# EAGLE design wt41u_breakout_board_v30 (EAGLE 7.5.0)
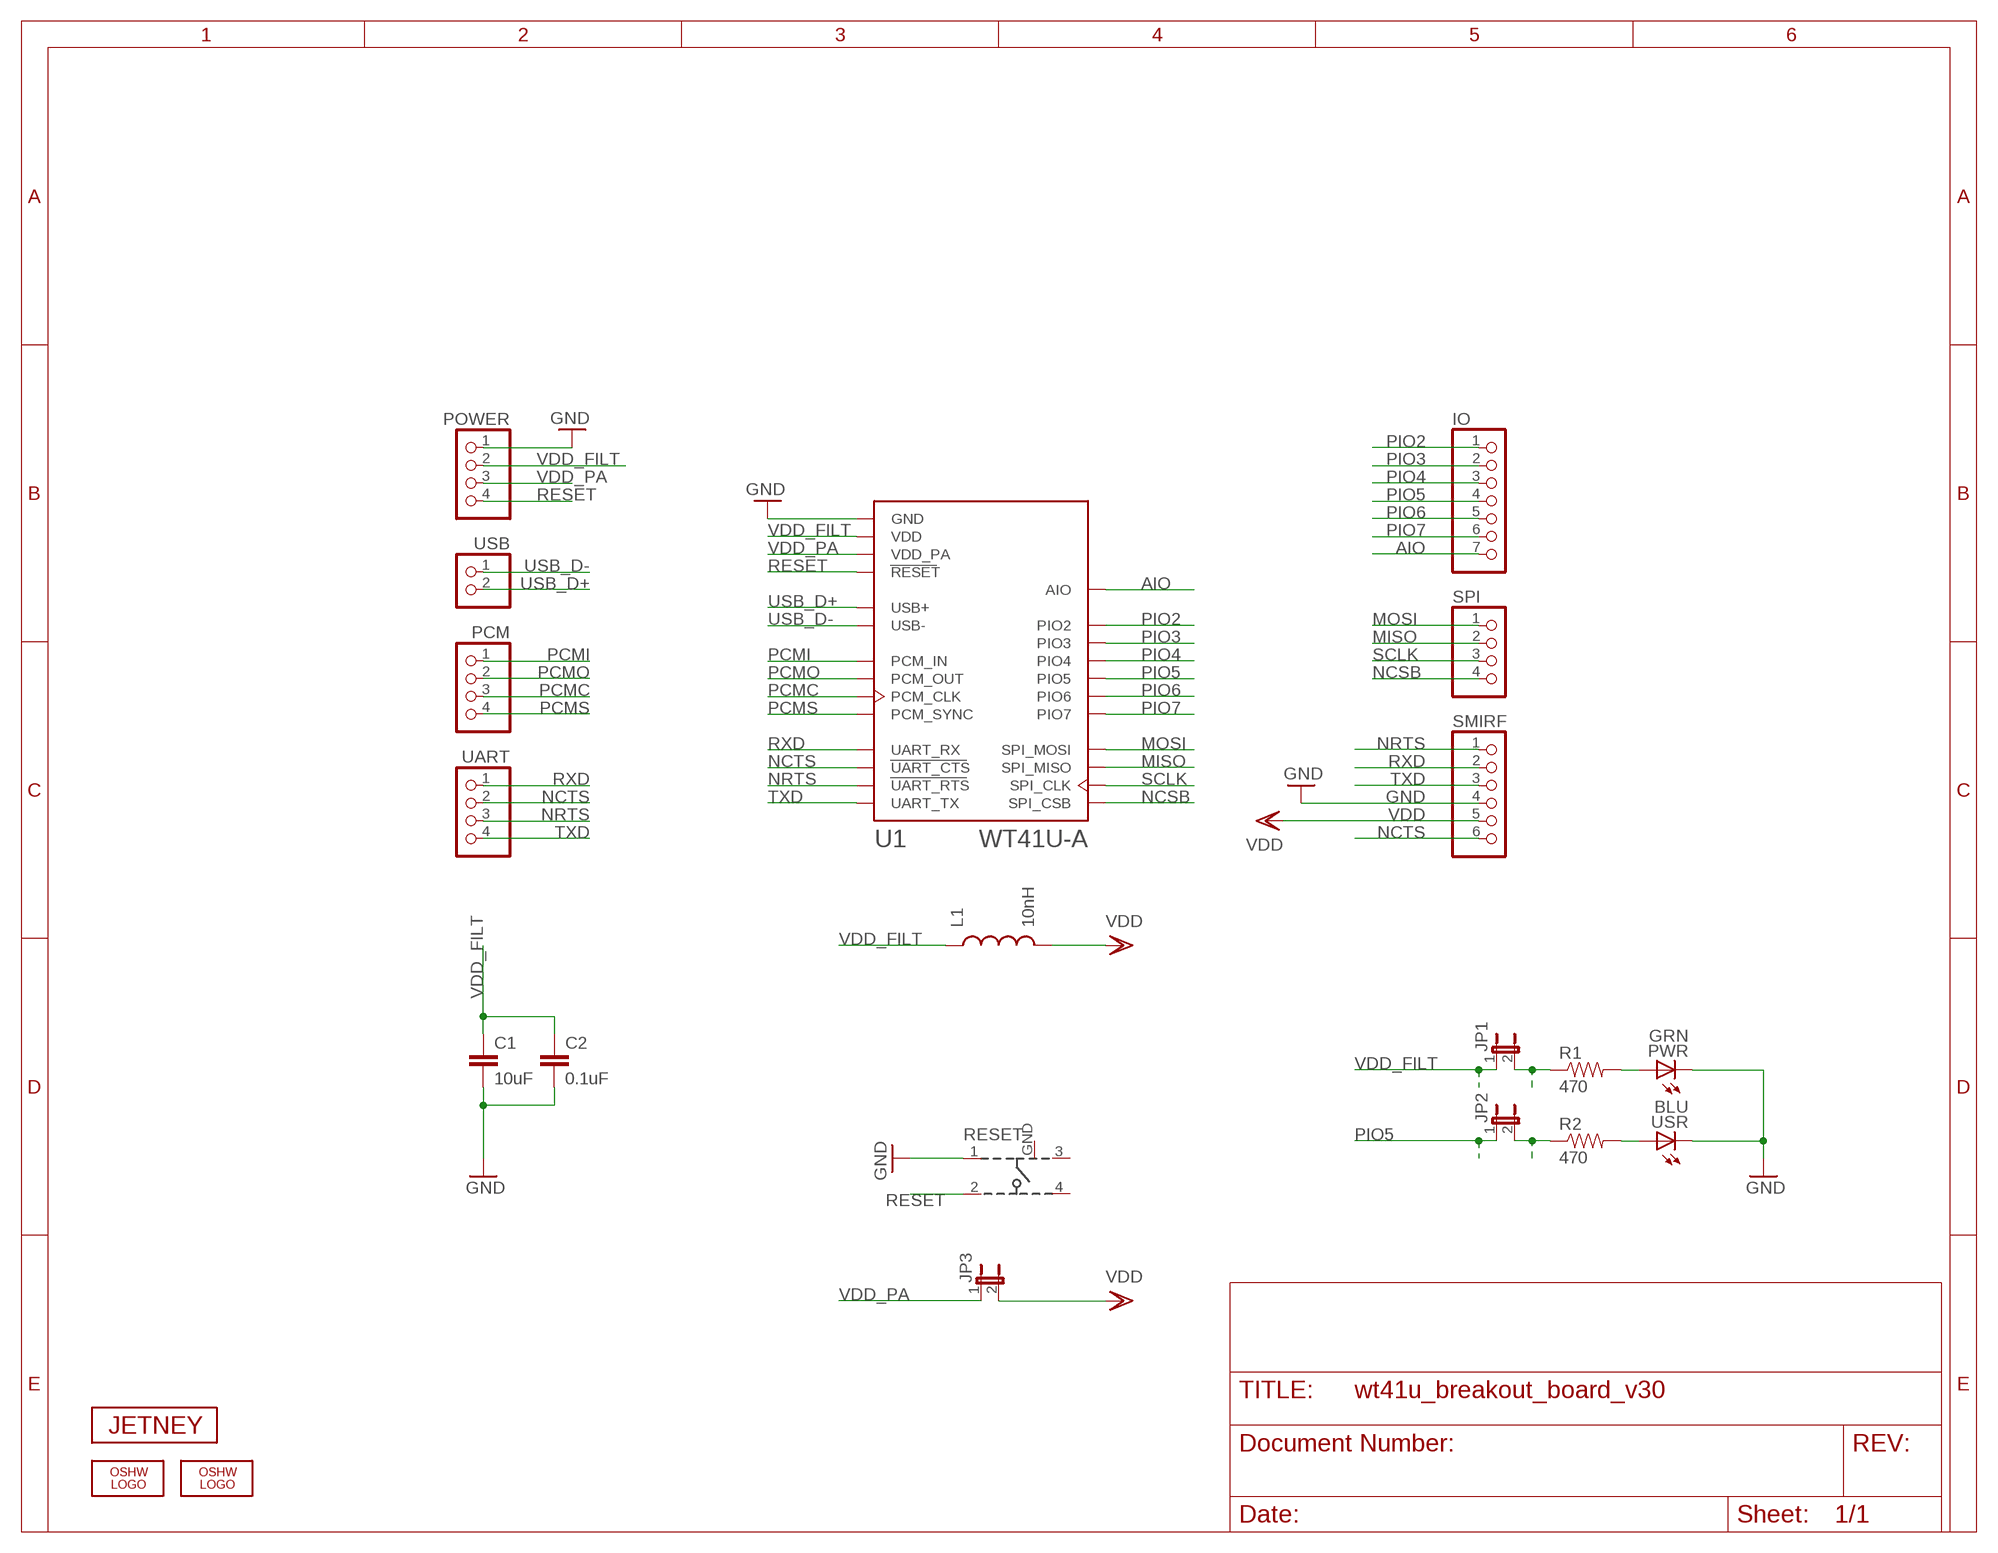
[diagram p0: schematic, sheet 1]

## Parts
C1  10uF  CAP0603-CAP  [0603-CAP]
C2  0.1uF  CAP0603-CAP  [0603-CAP]
IO  PINHD-1X7  [1X07]
JP1  JUMPER-2SMD-NC  [SJ_2S]
JP2  JUMPER-2SMD-NC  [SJ_2S]
JP3  JUMPER-2SMD-NC  [SJ_2S]
L1  10nH  INDUCTOR0603  [0603]
LOGO1  OSHW_LOGO_FILLX0070-NT  [OSHW_FILLX70_NOTEXT]
LOGO2  OSHW_LOGO_FILLX0070-NT  [OSHW_FILLX70_NOTEXT]
PCM  PINHD-1X4  [1X04]
POWER  PINHD-1X4  [1X04]
PWR  GRN  LEDCHIPLED_0805  [CHIPLED_0805]
R1  470  RESISTOR0603-RES  [0603-RES]
R2  470  RESISTOR0603-RES  [0603-RES]
RESET  101-IG  [101-IG]
SMIRF  PINHD-1X6  [1X06]
SPI  PINHD-1X4  [1X04]
U1  WT41U-A  [WT41U-A]
U$2  JETNEY-LOGO-12  [JETNEY-LOGO-12]
UART  PINHD-1X4  [1X04]
USB  PINHD-1X2  [1X02]
USR  BLU  LEDCHIPLED_0805  [CHIPLED_0805]

## Nets
AIO: IO.7 U1.AIO
GND [power]: C1.2 C2.2 POWER.1 PWR.C RESET.1 SMIRF.4 U1.GND U1.GND@2(GND) U1.GND@3(GND) U1.GND@4(GND) U1.GND@5(GND) U1.GND@6(GND) U1.GND@7(GND) U1.GND@8(GND) U1.GND@9(GND) U1.GND@10(GND) U1.GND@11(GND) U1.GND@12(GND) U1.GND@13(GND) U1.GND@14(GND) U1.GND@15(GND) U1.GND@16(GND) U1.GND@17(GND) U1.GND@18(GND) U1.GND@19(GND) U1.GND@20(GND) U1.GND@21(GND) U1.GND@22(GND) U1.GND@23(GND) U1.GND@24(GND) U1.GND@25(GND) U1.GND@26(GND) U1.GND@27(GND) U1.GND@28(GND) U1.GND@29(GND) U1.GND@30(GND) U1.GND@31(GND) USR.C
MISO: SPI.2 U1.SPI_MISO
MOSI: SPI.1 U1.SPI_MOSI
N$1: PWR.A R1.2
N$3: R2.2 USR.A
N$4: JP2.2 R2.1
NCSB: SPI.4 U1.SPI_CSB
NCTS: SMIRF.6 U1.UART_CTS UART.2
NRTS: SMIRF.1 U1.UART_RTS UART.3
PCMC: PCM.3 U1.PCM_CLK
PCMI: PCM.1 U1.PCM_IN
PCMO: PCM.2 U1.PCM_OUT
PCMS: PCM.4 U1.PCM_SYNC
PIO2: IO.1 U1.PIO2
PIO3: IO.2 U1.PIO3
PIO4: IO.3 U1.PIO4
PIO5: IO.4 JP2.1 U1.PIO5
PIO6: IO.5 U1.PIO6
PIO7: IO.6 U1.PIO7
RESET: POWER.4 RESET.2 U1.RESET
RXD: SMIRF.2 U1.UART_RX UART.1
SCLK: SPI.3 U1.SPI_CLK
TXD: SMIRF.3 U1.UART_TX UART.4
USB_D+: U1.USB+ USB.2
USB_D-: U1.USB- USB.1
VDD [power]: JP3.2 L1.2 SMIRF.5
VDD_FILT [power]: C1.1 C2.1 JP1.1 L1.1 POWER.2 U1.VDD
VDD_PA [power]: JP3.1 POWER.3 U1.VDD_PA
VDDJP1 [power]: JP1.2 R1.1
Unconnected: RESET.3 RESET.4

## Power pins joined to a net without a drawn wire
GND: RESET.GND

## Library data of the parts
C1 C2 = SparkFun:CAP: Capacitor Standard 0603 ceramic capacitor, and 0.1" leaded capacitor.
IO = sf-pinhead:PINHD-1X7: PIN HEADER
JP1-JP3 = SparkFun:JUMPER-2: Jumper Basic 0.1" spaced jumper. Use with breakaway headers.
L1 = SparkFun:INDUCTOR: Inductors Basic Inductor/Choke - 0603 and 1206. Footprints are not proven and vary greatly between part numbers.
LOGO1 LOGO2 = oshw-logo:OSHW_LOGO_FILL
PCM POWER SPI UART = sf-pinhead:PINHD-1X4: PIN HEADER
PWR USR = adafruit:LED: LED OSRAM: - CHIPLED LG R971, LG N971, LY N971, LG Q971, LY Q971, LO R971, LY R971 LH N974, LH R974 LS Q976, LO Q976, LY Q976 LO Q996 - Hyper CHIPLED LW Q18S LB Q993, LB Q99A, LB R99A - SideLED LS A670, LO A670, LY A670, LG A670, LP A670 LB A673, LV A673, LT A673, LW A673 LH A674 LY A675 LS A676, LA A676, LO A676, LY A676, LW A676 LS A679, LY A679, LG A679 - Hyper Micro SIDELED® LS Y876, LA Y876, LO Y876, LY Y876 LT Y87S - SmartLED LW L88C, LW L88S LB L89C, LB L89S, LG L890 LS L89K, LO L89K, LY L89K LS L896, LA L896, LO L896, LY L896 - TOPLED LS T670, LO T670, LY T670, LG T670, LP T670 LSG T670, LSP T670, LSY T670, LOP T670, LYG T670 LG T671, LOG T671, LSG T671 LB T673, LV T673, LT T673, LW T673 LH T674 LS T676, LA T676, LO T676, LY T676, LB T676, LH T676, LSB T676, LW T676 LB T67C, LV T67C, LT T67C, LS T67K, LO T67K, LY T67K, LW E67C LS E67B, LA E67B, LO E67B, LY E67B, LB E67C, LV E67C, LT E67C LW T67C LS T679, LY T679, LG T679 LS T770, LO T770, LY T770, LG T770, LP T770 LB T773, LV T773, LT T773, LW T773 LH T774 LS E675, LA E675, LY E675, LS T675 LS T776, LA T776, LO T776, LY T776, LB T776 LHGB T686 LT T68C, LB T68C - Hyper Mini TOPLED® LB M676 - Mini TOPLED Santana® LG M470 LS M47K, LO M47K, LY M47K Source: http://www.osram.convergy.de/
R1 R2 = SparkFun:RESISTOR: Resistor Basic schematic elements and footprints for 0603, 1206, and PTH resistors.
RESET = sf-keyglove:101-IG
SMIRF = sf-pinhead:PINHD-1X6: PIN HEADER
U1 = jetney-silabs-modules:WT41U: Bluegiga WT41 long-range Bluetooth module - Bluetooth 2.1 + EDR (+20 dBm, 1000m). WT41-A variant has an on-module ceramic chip antenna, WT41-E variant has a U.Fl connector. WT41-A variant should be mounted over a solid ground plane. Antenna edge of the module should be flush up agains the edge of the PCB. See datasheet for variant layout details. The WT41 is a fully integrated Bluetooth 2.1 + EDR, class 1 module combining antenna, Bluetooth radio, and an on-board iWRAP Bluetooth stack. The WT41 provides a superior 110dB link budget and more than 1000-meter line-of-sight connectivity for Bluetooth applications where extreme radio performance or reliability is required. It also constitutes an ideal solution for developers that want to quickly integrate extremely high performing Bluetooth wireless technology into their design without investing several months in Bluetooth radio and stack development. The WT41 uses Bluegiga's iWRAP Bluetooth stack, which is an embedded Bluetooth stack implementing 13 different Bluetooth profiles and Apple iAP connectivity. By using WT41 combined with iWRAP Bluetooth stack and Bluegiga's excellent technical support, designers ensure quick time-to-market, and low development costs and risks. http://www.bluegiga.com/en-US/products/bluetooth-classic-modules/wt41-long-range-bluetooth--module https://github.com/jrowberg/sf-oshw Last updated 2014-01-04 by Jeff Rowberg <jeff@rowberg.net>; ANTENNA: On-module ceramic chip antenna
U$2 = sf-keyglove:JETNEY-LOGO
USB = sf-pinhead:PINHD-1X2: PIN HEADER

## Net classes
0 default: width 0.152 mm, drill 0.33 mm, clearance 0.152 mm
1 power: width 0.254 mm, drill 0.33 mm, clearance 0.152 mm

## Board
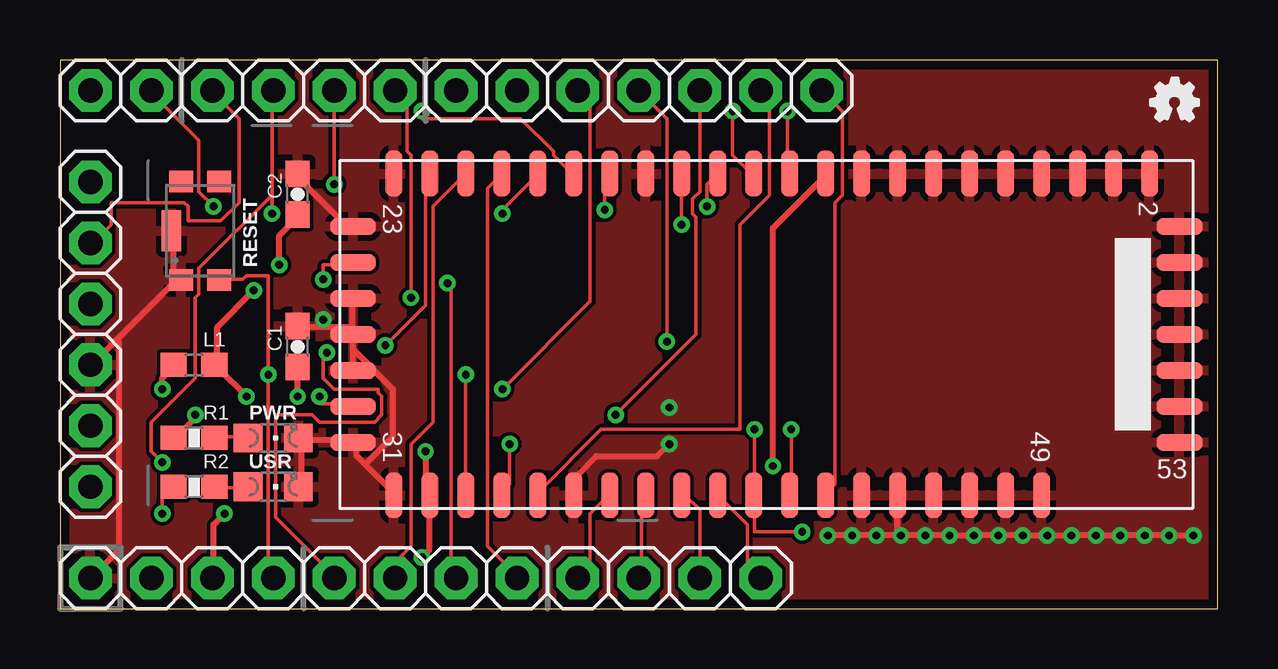
[diagram p1: board, top side]
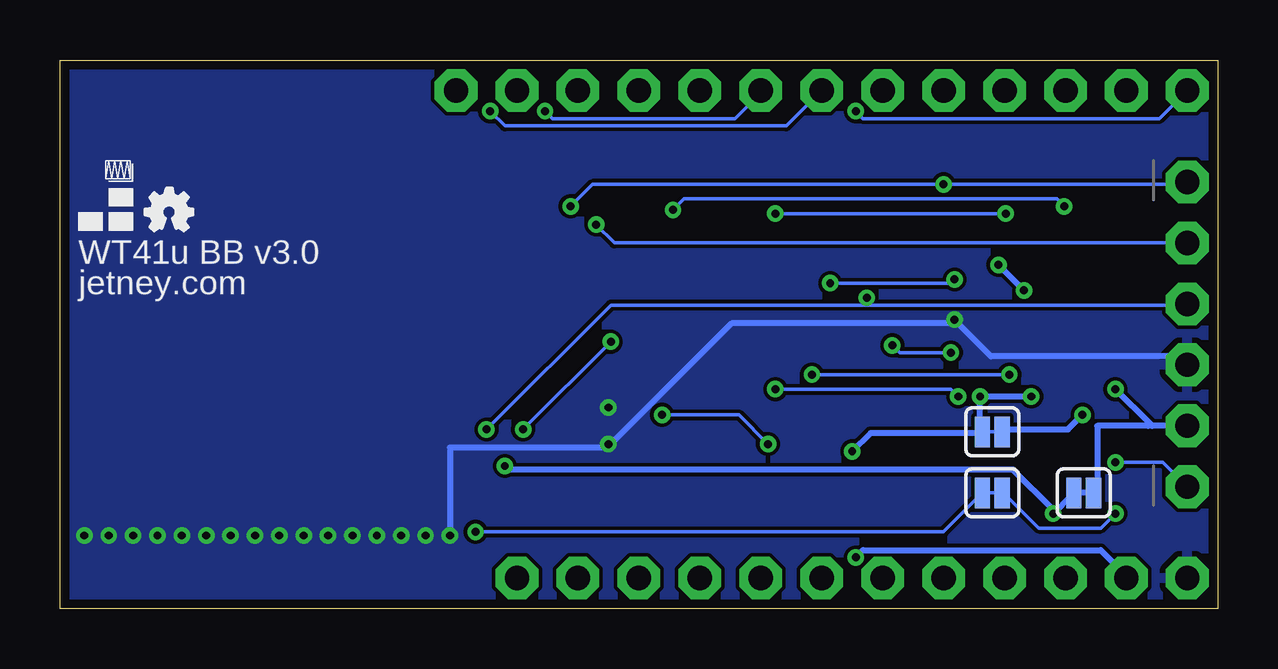
[diagram p2: board, bottom side, seen from below]

Size 48.26 x 22.86 mm. Coordinates in mm from the lower left corner, seen from the top.
Outline: 0,0 48.26,0 48.26,22.86 0,22.86 0,0
Copper layers (1*16): Top 0.0356mm / dielectric 1.5011mm / Bottom 0.0356mm
Design rules "LaenPCBOrder *": minimum track width 6mil, minimum drill 13mil, track to track 6mil, track to pad 6mil, pad to pad 6mil, via to via 6mil, smd to smd 6mil, copper to edge 15mil, drill to drill 6mil, minimum pad ring 7mil, minimum via ring 7mil, stop-mask expansion 4mil, vias tented up to drill 13mil, thermal gap 10mil
vRestrict: area 0,19.3 to 33,20.3; area 0,2.5 to 30.5,3.6; area 2.5,3.8 to 3.8,19.1; area 8.4,5.8 to 9.9,6.3; area 8.4,7.9 to 9.9,8.4

### Footprints (pad centres in the part's own frame; a part is rotated, then mirrored left to right if it is on the bottom)
0603-CAP = smd 1.1 x 1: 1 -0.85,0; 2 0.85,0
1X07 = drill 1.016 pad 1.778 octagon: 1 -7.62,0; 2 -5.08,0; 3 -2.54,0; 4 0,0; 5 2.54,0; 6 5.08,0; 7 7.62,0
SJ_2S = smd 0.635 x 1.27: 1 -0.412,0; 2 0.412,0
0603 = smd 1.1 x 1: 1 -0.85,0; 2 0.85,0
1X04 = drill 1.016 pad 1.778 octagon: 1 -3.81,0; 2 -1.27,0; 3 1.27,0; 4 3.81,0
CHIPLED_0805 = smd 1.2 x 1.2: A 0,-1.05; C 0,1.05
0603-RES = smd 1.1 x 1: 1 -0.85,0; 2 0.85,0
101-IG = smd 0.9 x 1: 1 -2.05,0.8; 2 -2.05,-0.8; 3 2.05,0.8; 4 2.05,-0.8 | smd 1.7 x 0.8: GND 0,1.2
1X06 = drill 1.016 pad 1.778 octagon: 1 -6.35,0; 2 -3.81,0; 3 -1.27,0; 4 1.27,0; 5 3.81,0; 6 6.35,0
WT41U-A = smd 1.9 x 0.7: AIO 6.7,2.45; GND -6.7,15.95; GND@2 -6.7,14.45; GND@3 -6.7,12.95; GND@4 -6.7,11.45; GND@5 -6.7,9.95; GND@6 -6.7,8.45; GND@7 -6.7,6.95; GND@8 -6.7,5.45; GND@9 -6.7,3.95; GND@10 -6.7,-5.05; GND@11 -6.7,-15.55; GND@17 6.7,-15.55; GND@18 6.7,-8.05; GND@19 6.7,3.95; GND@20 6.7,5.45; GND@21 6.7,6.95; GND@22 6.7,8.45; GND@23 6.7,9.95; GND@24 6.7,11.45; PCM_CLK -6.7,-12.55; PCM_IN -6.7,-11.05; PCM_SYNC -6.7,-14.05; PIO2 -6.7,0.95; PIO3 -6.7,-0.55; PIO5 6.7,-0.55; PIO6 6.7,-11.05; PIO7 6.7,-9.55; RESET 6.7,-12.55; SPI_CLK 6.7,-5.05; SPI_CSB 6.7,-6.55; SPI_MISO 6.7,-3.55; SPI_MOSI 6.7,-2.05; UART_CTS -6.7,-9.55; UART_RTS -6.7,-2.05; UART_RX -6.7,-3.55; UART_TX 6.7,0.95; USB+ -6.7,-6.55; USB- -6.7,-8.05; VDD 6.7,-14.05; VDD_PA -6.7,2.45 | smd 0.7 x 1.9: GND@12 -4.5,-17.25; GND@13 -1.5,-17.25; GND@14 0,-17.25; GND@15 1.5,-17.25; GND@16 4.5,-17.25; GND@25 4.5,17.2; GND@26 3,17.2; GND@27 1.5,17.2; GND@28 0,17.2; GND@29 -1.5,17.2; GND@30 -3,17.2; GND@31 -4.5,17.2; PCM_OUT -3,-17.25; PIO4 3,-17.25
1X02 = drill 1.016 pad 1.778 octagon: 1 -1.27,0; 2 1.27,0

### Placement (x,y rotation side)
C1  9.91,10.92 90 top
C2  9.91,17.27 90 top
IO  24.13,21.59 0 top
JP1  9.4,7.37 0 bottom
JP2  9.4,4.83 0 bottom
JP3  5.59,4.83 0 bottom
L1  5.59,10.16 180 top
LOGO1  45.47,20.32 0 top
LOGO2  44.7,15.75 0 bottom
PCM  15.24,1.27 180 top
POWER  5.08,1.27 0 top
PWR  8.89,7.11 270 top
R1  5.59,7.11 0 top
R2  5.59,5.08 0 top
RESET  5.84,15.75 90 top
SMIRF  1.27,11.43 270 top
SPI  25.4,1.27 180 top
U1  29.46,11.43 270 top
U$2  47.5,15.75 0 bottom
UART  10.16,21.59 0 top
USB  2.54,21.59 0 top
USR  8.89,5.08 270 top

### Tracks (layer width: path | path; a pad name or v marks a point on that pad's centre or on a via)
AIO
  Top 0.152: IO.7 32.61,20.73 32.61,17.22 32.31,16.92 32.31,5.18 32,4.88 31.91,4.88 U1.AIO
GND  (via drill 0.33)
  Top 0.254: v47.24,3.05 v46.23,3.05 v45.21,3.05 v44.2,3.05 v43.18,3.05 v42.16,3.05 v41.15,3.05 v40.13,3.05 v39.12,3.05 v38.1,3.05 v37.08,3.05 v36.07,3.05 v35.05,3.05 34.9,3.05 | v32,3.05 v33.02,3.05 v34.04,3.05 34.9,3.05 | 34.9,3.05 U1.GND@20 | 10.06,7.01 10.06,5.18 USR.C | 12.19,7.01 10.06,7.01 | 10.06,7.01 PWR.C | 12.72,6.02 12.34,6.4 12.34,6.86 | 12.72,6.02 13.87,4.88 | 12.19,11.73 10.97,11.73 | 10.97,11.73 9.91,11.73 C1.2 | 12.19,11.73 12.19,10.82 | 12.19,10.82 12.19,10.06 | 12.19,11.73 12.19,12.8 | C2.2 9.91,17.98 11.89,16 12.19,16 12.19,15.93 U1.GND@12 | 12.72,6.02 13.87,7.16 13.87,9.14 12.19,10.82 | RESET.GND 4.72,15.7 4.72,14.02 5.03,13.72 RESET.1 4.88,13.72 2.36,11.2 | 2.36,11.2 1.37,10.21 SMIRF.4 | POWER.1 2.44,2.44 2.44,11.12 2.36,11.2 | v10.97,12.04 10.97,11.73 | U1.GND@18 21.59,4.73 21.59,5.59 22.35,6.35 24.89,6.35 v25.4,6.86
  Bottom 0.254: SMIRF.4 1.37,10.21 1.68,10.52 9.45,10.52 v10.97,12.04 10.97,11.89 20.27,11.89 25.45,6.71 32,6.71 v32,3.05
  other vias: 25.4,8.38
  pour Top: 0,22.86 48.26,22.86 48.26,0 0,0
  pour Bottom: 0,22.86 48.26,22.86 48.26,0 0,0
MISO
  Top 0.152: SPI.2 26.67,4.12 26.06,4.72 26.06,4.73 U1.SPI_MISO
MOSI
  Top 0.152: SPI.1 28.65,1.83 28.65,3.5 27.43,4.72 U1.SPI_MOSI
N$1
  Top 0.152: R1.2 6.55,7.16 7.77,7.16 PWR.A
N$2
  Bottom 0.152: 9.14,7.37 9.65,7.37
N$3
  Top 0.152: R2.2 6.55,5.03 7.77,5.03 USR.A
N$4  (via drill 0.33)
  Top 0.152: v4.27,3.96 4.27,4.57 4.72,5.03 R2.1
  Bottom 0.152: v4.27,3.96 4.88,3.35 7.47,3.35 8.84,4.72 JP2.2
N$5
  Bottom 0.152: 9.14,4.83 9.65,4.83
N$6
  Bottom 0.254: 5.33,4.83 5.84,4.83
NCSB
  Top 0.152: SPI.4 21.64,1.37 22.1,1.83 22.1,3.96 22.86,4.72 22.86,4.73 U1.SPI_CSB
NCTS  (via drill 0.33)
  Top 0.152: v18.44,16.46 18.44,16.61 19.81,17.98 19.91,17.98 U1.UART_CTS | 8.84,17.22 8.84,21.49 UART.2 | 8.84,17.22 v8.84,16.46 | v4.27,6.1 3.81,6.55 3.81,7.77 5.64,9.6 5.64,12.95 5.79,13.11 5.79,14.17 8.84,17.22
  Bottom 0.152: v8.84,16.46 v18.44,16.46 | SMIRF.6 2.29,6.1 v4.27,6.1
NRTS  (via drill 0.33)
  Top 0.152: v26.98,16.76 26.98,17.68 27.28,17.98 27.28,18.13 U1.UART_RTS | v11.43,17.68 UART.3
  Bottom 0.152: v26.98,16.76 26.06,17.68 v11.43,17.68 1.37,17.68 SMIRF.1
PCMC
  Top 0.152: PCM.3 14.02,1.37 14.02,1.98 14.63,2.59 14.63,6.86 15.54,7.77 15.54,16.76 16.76,17.98 16.76,18.13 U1.PCM_CLK
PCMI
  Top 0.152: PCM.1 19.05,1.37 17.83,2.59 17.83,17.53 18.29,17.98 18.29,18.13 U1.PCM_IN
PCMO  (via drill 0.33)
  Top 0.152: v10.97,13.72 10.97,14.33 12.19,14.33 12.19,14.43 U1.PCM_OUT | v16.15,13.56 16.31,13.41 16.31,1.52 16.46,1.37 PCM.2
  Bottom 0.152: v10.97,13.72 11.12,13.56 v16.15,13.56
PCMS  (via drill 0.33)
  Top 0.152: v13.56,10.97 15.24,12.65 15.24,17.83 15.39,17.98 15.41,17.98 U1.PCM_SYNC | v11.12,10.67 10.97,10.52 10.97,9.6 11.43,9.14 13.26,9.14 13.26,8.99 13.41,8.84 13.41,8.08 13.11,7.77 10.82,7.77 10.52,8.08 8.99,8.08 8.99,3.81 11.43,1.37 PCM.4
  Bottom 0.152: v13.56,10.97 13.26,10.67 v11.12,10.67
PIO2  (via drill 0.33)
  Top 0.152: v30.33,20.73 30.33,18.14 U1.PIO2
  Bottom 0.152: v30.33,20.73 29.72,20.12 17.98,20.12 IO.1
PIO3  (via drill 0.33)
  Top 0.152: v28.04,20.73 28.04,18.9 28.8,18.14 U1.PIO3
  Bottom 0.152: v28.04,20.73 27.74,20.42 20.12,20.42 19.05,21.49 IO.2
PIO4  (via drill 0.33)
  Top 0.152: v10.82,8.84 10.82,8.53 12.21,8.53 U1.PIO4 | v18.44,9.14 22.1,12.8 22.1,21.03 21.64,21.49 IO.3
  Bottom 0.152: v10.82,8.84 11.12,9.14 v18.44,9.14
PIO5  (via drill 0.33)
  Top 0.152: v30.94,3.2 28.96,3.2 28.96,4.72 U1.PIO5 28.91,4.88 28.96,4.88 v28.96,7.47 | IO.4 25.3,20.42 v25.3,11.12
  Bottom 0.152: v30.94,3.2 11.43,3.2 9.91,4.72 JP2.1 | v28.96,7.47 v25.3,11.12
PIO6  (via drill 0.33)
  Top 0.152: v18.75,6.86 18.75,5.18 18.44,4.88 18.44,4.73 U1.PIO6 | v23.16,8.08 26.52,11.43 26.52,16.31 26.36,16.46 26.36,17.07 26.67,17.37 IO.5
  Bottom 0.152: v18.75,6.86 19.96,8.08 v23.16,8.08
PIO7
  Top 0.152: IO.6 29.26,21.49 29.57,21.18 29.57,17.22 28.35,16 28.35,7.47 22.55,7.47 19.96,4.88 19.91,4.88 U1.PIO7
RESET  (via drill 0.33)
  Top 0.152: RESET.2 6.71,13.72 7.62,13.72 7.77,13.87 8.69,13.87 v8.69,9.75 8.69,1.52 8.84,1.37 POWER.4 | v16.92,9.75 U1.RESET
  Bottom 0.152: v8.69,9.75 v16.92,9.75
RXD  (via drill 0.33)
  Top 0.152: v25.91,16 U1.UART_RX | UART.1 6.4,21.49 7.47,20.42 7.47,16.92 6.71,16.15 5.33,16.15 5.33,16.76 5.18,16.92 2.13,16.92 2.13,16 1.37,15.24 SMIRF.2
  Bottom 0.152: v25.91,16 25.15,15.24 SMIRF.2
SCLK
  Top 0.152: SPI.3 24.23,1.37 24.23,4.57 24.38,4.72 24.38,4.73 U1.SPI_CLK
TXD  (via drill 0.33)
  Top 0.152: v30.48,7.47 30.48,4.88 30.41,4.88 U1.UART_TX | v14.63,12.95 14.63,18.9 14.48,19.05 14.48,21.03 14.02,21.49 UART.4
  Bottom 0.152: v30.48,7.47 25.3,12.65 14.63,12.65 | 14.63,12.65 1.37,12.65 SMIRF.3 | 14.63,12.65 v14.63,12.95
USB_D+  (via drill 0.33)
  Top 0.152: v22.71,16.61 22.71,17.83 22.86,17.98 22.86,18.13 U1.USB+ | v6.4,16.76 5.79,17.37 5.79,19.51 3.81,21.49 USB.2
  Bottom 0.152: v22.71,16.61 22.25,17.07 6.71,17.07 v6.4,16.76
USB_D-  (via drill 0.33)
  Top 0.152: 21.26,18.21 20.57,18.9 20.57,19.05 19.2,20.42 15.09,20.42 v15.09,20.73 | 21.26,18.21 21.34,18.14 | U1.USB- 21.26,18.13 21.26,18.21
  Bottom 0.152: v15.09,20.73 14.78,20.42 2.44,20.42 USB.1
VDD  (via drill 0.33)
  Top 0.254: v4.27,9.14 4.27,9.6 4.72,10.06 L1.2
  Bottom 0.254: 2.82,7.7 2.74,7.62 SMIRF.5 | 2.82,7.7 v4.27,9.14 | JP3.2 5.03,4.88 5.03,7.62 2.9,7.62 2.82,7.7
VDD_FILT  (via drill 0.33)
  Top 0.254: v9.91,8.84 C1.1 | v7.77,8.84 6.55,10.06 L1.1 6.55,10.21 6.55,11.73 v8.08,13.26 | v9.14,14.33 9.14,15.54 9.91,16.31 C2.1 | v15.24,6.55 15.24,5.03 15.39,4.88 15.41,4.88 U1.VDD 15.39,4.73 15.39,4.57 | v15.09,2.13 15.39,2.44 15.39,4.57 | 15.39,4.72 15.39,4.57
  Bottom 0.254: v7.77,8.84 v9.91,8.84 9.91,7.47 JP1.1 9.91,7.32 14.48,7.32 v15.24,6.55 | v8.08,13.26 v9.14,14.33 | v15.09,2.13 14.78,2.44 4.88,2.44 3.81,1.37 POWER.2
VDD_PA  (via drill 0.33)
  Top 0.254: v6.86,3.96 6.4,3.5 6.4,1.37 POWER.3 | v29.72,5.94 29.72,15.85 31.85,17.98 31.91,17.98 U1.VDD_PA
  Bottom 0.254: JP3.1 6.1,4.72 v6.86,3.96 6.86,4.12 8.53,5.79 29.57,5.79 v29.72,5.94
VDDJP1  (via drill 0.33)
  Top 0.254: v5.64,8.08 5.64,7.92 4.88,7.16 R1.1
  Bottom 0.254: v5.64,8.08 6.25,7.47 8.84,7.47 JP1.2

### Text on the board
bPlace: WT41u BB v3.0 | jetney.com
tDocu: D- D+ | RTS RXD TXD GND 3V3 CTS | RXD CTS RTS TXD | P2 P3 P4 P5 P6 P7 | AIO | Bluegiga / WT41u-A | GND 3V3 VPA RES SYN CLK OUT CSB SCK | IN | MISO | MOSI
bDocu: RTS RXD TXD GND 3V3 CTS | PWR | VDDPA | PIO5